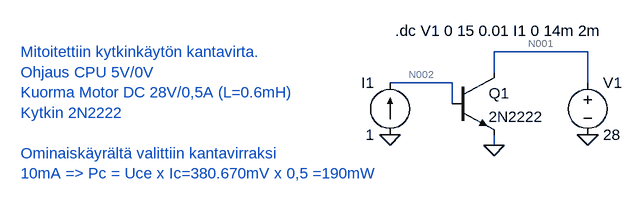
[diagram p0: schematic HT_teht6_kantavirta.asc]
HT_teht6_kantavirta.asc, the LTspice schematic file:
Version 4
SHEET 1 880 680
WIRE 368 80 224 80
WIRE 224 112 224 80
WIRE 160 128 64 128
WIRE 368 128 368 80
WIRE 160 160 160 128
WIRE 224 224 224 208
FLAG 64 208 0
FLAG 224 224 0
FLAG 368 208 0
SYMBOL npn 160 112 R0
SYMATTR InstName Q1
SYMATTR Value 2N2222
SYMBOL voltage 368 112 R0
WINDOW 123 0 0 Left 2
WINDOW 39 0 0 Left 2
SYMATTR InstName V1
SYMATTR Value 28
SYMBOL current 64 208 R180
WINDOW 0 24 80 Left 2
WINDOW 3 24 0 Left 2
WINDOW 123 0 0 Left 2
WINDOW 39 0 0 Left 2
SYMATTR InstName I1
SYMATTR Value 1
TEXT 72 48 Left 2 !.dc V1 0 15 0.01 I1 0 14m 2m
TEXT -504 80 Left 2 ;Mitoitettiin kytkinkäytön kantavirta.\nOhjaus CPU 5V/0V\nKuorma Motor DC 28V/0,5A (L=0.6mH)\nKytkin 2N2222\n \nOminaiskäyrältä valittiin kantavirraksi\n10mA => Pc = Uce x Ic=380.670mV x 0,5 =190mW

The netlist it stands for:
* HT_teht6_kantavirta.asc
Q1 N001 N002 0 0 2N2222
V1 N001 0 28
I1 0 N002 1
.model NPN NPN
.model PNP PNP
.lib standard.bjt
.dc V1 0 15 0.01 I1 0 14m 2m
* Mitoitettiin kytkinkäytön kantavirta.
* Ohjaus CPU 5V/0V
* Kuorma Motor DC 28V/0,5A (L=0.6mH)
* Kytkin 2N2222
* Ominaiskäyrältä valittiin kantavirraksi
* 10mA => Pc = Uce x Ic=380.670mV x 0,5 =190mW
.backanno
.end

* Results of the author's LTspice run, read from the files saved beside the schematic
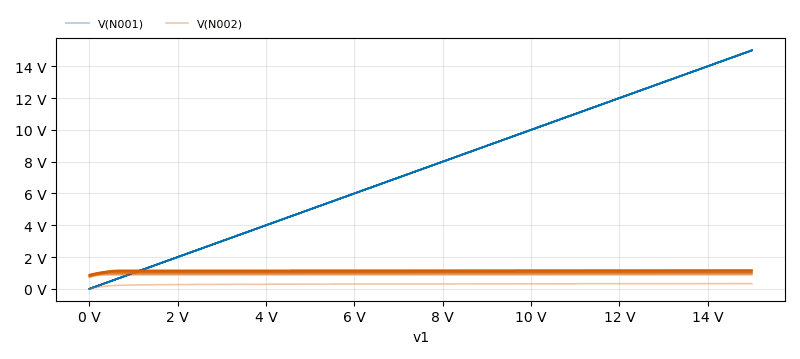
[diagram p1: DC transfer characteristic of HT_teht6_kantavirta.asc, plotted from the saved traces]
* DC transfer characteristic, 8 runs:
*   V(N001) [i1=0]: 0 V at v1=0 V, 15 V at v1=15 V, min 0 V, max 15 V
*   V(N001) [i1=0.002]: 0 V at v1=0 V, 15 V at v1=15 V, min 0 V, max 15 V
*   V(N001) [i1=0.004]: 0 V at v1=0 V, 15 V at v1=15 V, min 0 V, max 15 V
*   V(N001) [i1=0.006]: 0 V at v1=0 V, 15 V at v1=15 V, min 0 V, max 15 V
*   V(N001) [i1=0.008]: 0 V at v1=0 V, 15 V at v1=15 V, min 0 V, max 15 V
*   V(N001) [i1=0.01]: 0 V at v1=0 V, 15 V at v1=15 V, min 0 V, max 15 V
*   V(N001) [i1=0.012]: 0 V at v1=0 V, 15 V at v1=15 V, min 0 V, max 15 V
*   V(N001) [i1=0.014]: 0 V at v1=0 V, 15 V at v1=15 V, min 0 V, max 15 V
*   V(N002) [i1=0]: 0 V at v1=0 V, 325.1 mV at v1=15 V, min 0 V, max 325.1 mV
*   V(N002) [i1=0.002]: 721.6 mV at v1=0 V, 882.4 mV at v1=15 V, min 721.6 mV, max 882.4 mV
*   V(N002) [i1=0.004]: 760 mV at v1=0 V, 951.4 mV at v1=15 V, min 760 mV, max 951.4 mV
*   V(N002) [i1=0.006]: 791 mV at v1=0 V, 1.006 V at v1=15 V, min 791 mV, max 1.006 V
*   V(N002) [i1=0.008]: 818.8 mV at v1=0 V, 1.055 V at v1=15 V, min 818.8 mV, max 1.055 V
*   V(N002) [i1=0.01]: 845 mV at v1=0 V, 1.099 V at v1=15 V, min 845 mV, max 1.099 V
*   V(N002) [i1=0.012]: 870.1 mV at v1=0 V, 1.141 V at v1=15 V, min 870.1 mV, max 1.141 V
*   V(N002) [i1=0.014]: 894.5 mV at v1=0 V, 1.18 V at v1=15 V, min 894.5 mV, max 1.18 V